# Altium project BOOST-DRV8711.PrjPcb
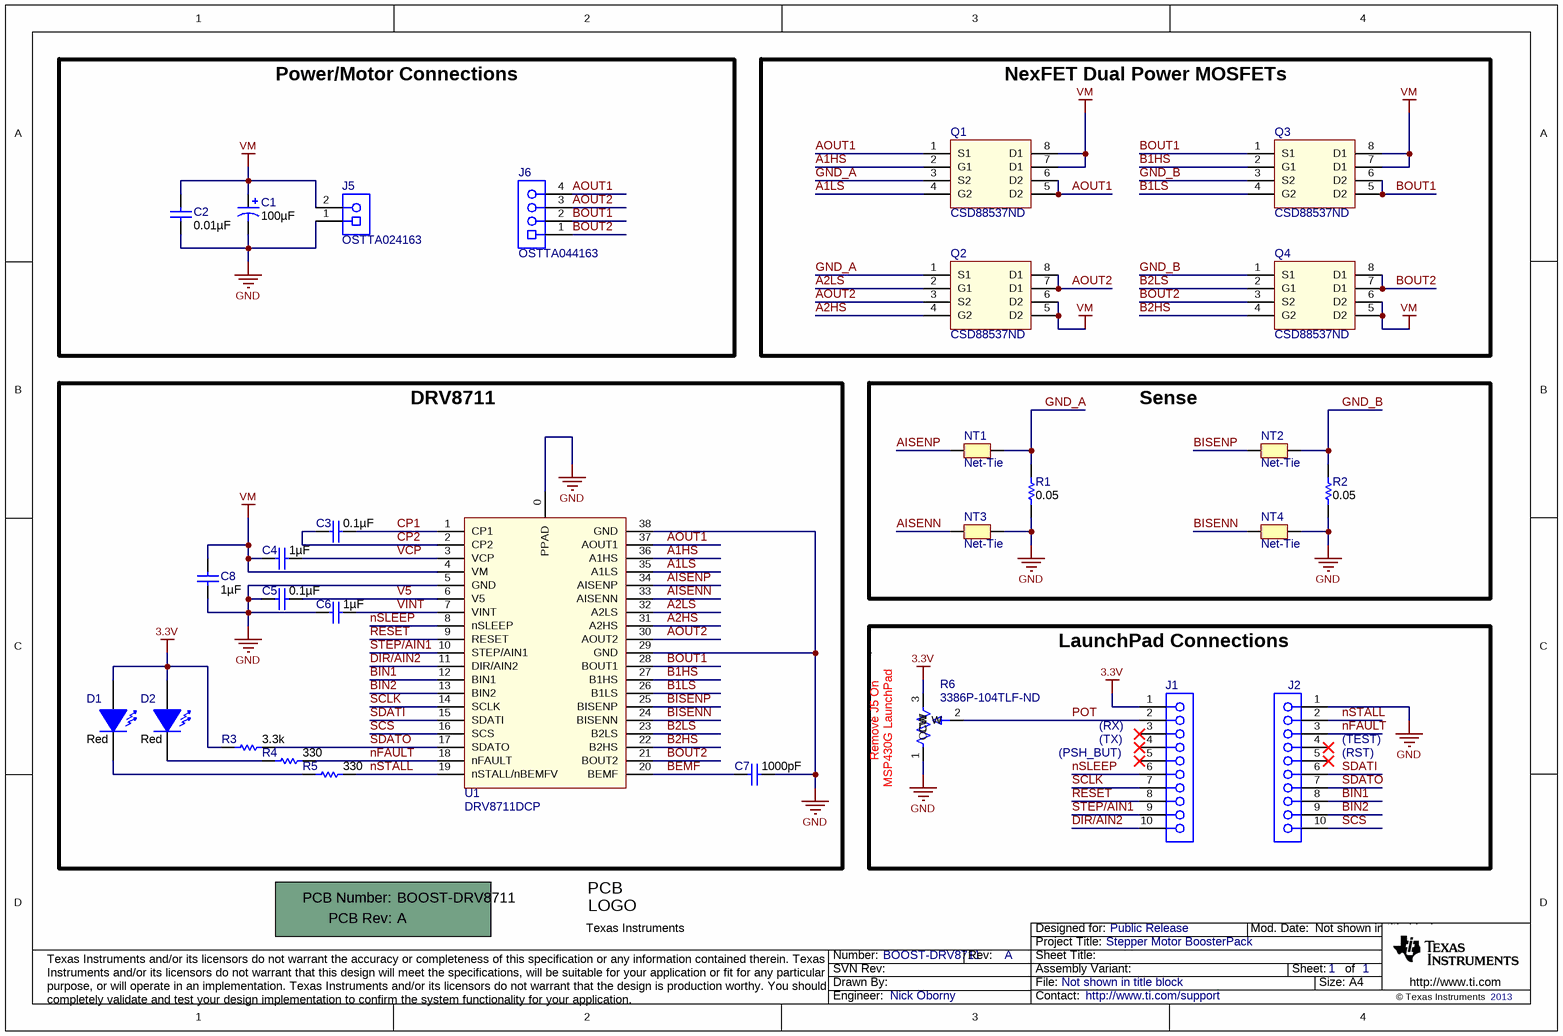
[diagram p0: BOOST-DRV8711.SchDoc]
TechSupport: http://www.ti.com/support; SCH_Rev: A; PRJ_Title: Stepper Motor BoosterPack; PRJ_Number: BOOST-DRV8711; PRJ_Engineer: Nick Oborny; PRJ_Customer: Public Release; PCB_Rev: A; PCB_Layout: Nick Oborny; CopyrightYear: 2013
1 sheet, 31 parts. Net scope: global (net labels, ports and power ports of the same name join across sheets).
Board file: BOOST-DRV8711.PcbDoc

## Sheet BOOST-DRV8711.SchDoc
size A4; Date: Not shown in title block; ApprovedBy: Not shown in title block; CheckedBy: Not shown in title block; Author: Not shown in title block; CompanyName: Not shown in title block; Engineer: Not shown in title block; Organization: Not shown in title block; Address1: Not shown in title block; Address2: Not shown in title block; Address3: Not shown in title block; Address4: Not shown in title block; DocumentNumber: 1; Revision: Use project parameter SCH_Rev; SheetNumber: 1; SheetTotal: 1; PageSetup: Record=PageOptions|CenterHorizontal=True|CenterVertical=True|PrintScale=1.00|XCorrection=1.00|YCorrection=1.00|PrintKind=0|BorderSize=5000000|LeftOffset=0|BottomOffset=0|Orientation=2|PaperLength=1000|PaperWidth=1000|Scale=100|PaperSource=15|PrintQuality=600|MediaType=1|DitherType=10|PaperKind=Letter|PrintScaleMode=1; CurrentTime: Not shown in title block; CurrentDate: Not shown in title block; Time: Not shown in title block; DocumentFullPathAndName: Not shown in title block; DocumentName: Not shown in title block; ModifiedDate: Not shown in title block; ImagePath: Not shown in title block

### Parts
!PCB  Printed Circuit Board  (value not drawn)  (mechanical)
C1  ValueDisplayed: 100µF  [CAPPR5-10X20]  (hidden comment: ECA-2AM101)
C2  ValueDisplayed: 0.01µF  [0603L]  (hidden comment: C1608X7R2A103K)
C3  ValueDisplayed: 0.1µF  [0603L]  (hidden comment: GRM188R72A104KA35D)
C4  ValueDisplayed: 1µF  [0805L]  (hidden comment: CL21B105KBFNNNE)
C5  ValueDisplayed: 0.1µF  [0603L]  (hidden comment: C1608X7R1E104K)
C6  ValueDisplayed: 1µF  [0603L]  (hidden comment: C1608X7R1C105K)
C7  ValueDisplayed: 1000pF  [0603L]  (hidden comment: C0603C102K4RACTU)
C8  ValueDisplayed: 1µF  [1206L]  (hidden comment: HMK316B7105KL-T)
D1  value Red  [LED_LTST-C170]  (hidden comment: LTST-C170KRKT)
D2  value Red  [LED_LTST-C170]  (hidden comment: LTST-C170KRKT)
J1  CRD-081413-B-T  [CONN_SSW-110-23-F-S]  (value not drawn)
J2  CRD-081413-B-T  [CONN_SSW-110-23-F-S]  (value not drawn)
J5  OSTTA024163  [CONN_ED120-2DS]
J6  OSTTA044163  [CONN_ED120_4DS]
Logo1  Texas Instruments  [TI_Symbol_Overlay_Small]  (no BOM)
NT1  Net-Tie  [Net-Tie_10mil]  (net tie, no BOM)
NT2  Net-Tie  [Net-Tie_10mil]  (net tie, no BOM)
NT3  Net-Tie  [Net-Tie_10mil]  (net tie, no BOM)
NT4  Net-Tie  [Net-Tie_10mil]  (net tie, no BOM)
Q1  CSD88537ND  [SO-8]
Q2  CSD88537ND  [SO-8]
Q3  CSD88537ND  [SO-8]
Q4  CSD88537ND  [SO-8]
R1  value 0.05  [2512M]  (hidden comment: CRA2512-FZ-R050ELF)
R2  value 0.05  [2512M]  (hidden comment: CRA2512-FZ-R050ELF)
R3  value 3.3k  [0603L]  (hidden comment: CRCW06033K30JNEA)
R4  value 330  [0603L]  (hidden comment: CRCW0603330RJNEA)
R5  value 330  [0603L]  (hidden comment: CRCW0603330RJNEA)
R6  3386P-104TLF-ND  [POT_3386P]
U1  DRV8711DCP  [R-PDSO-G38]

### Blocks framed on the sheet
Power/Motor Connections: C1 C2 J5 J6
NexFET Dual Power MOSFETs: Q1-Q4
DRV8711: C3-C8 D1 D2 R3-R5 U1
Sense: NT1-NT4 R1 R2

### Nets
3.3V: D1.1(A) D2.1(A) J1.1 R3.2 R6.3(CW)
GND: C1.2(-) C2.2 C5.2 C6.2 C7.2 C8.2 J2.1 J5.1 NT3.2 NT4.2 R1.1 R2.1 R6.1(CCW) U1.0(PPAD) U1.5(GND) U1.29(GND) U1.38(GND)
VM: C1.1(+) C2.1 C4.2 C8.1 J5.2 Q1.7(D1) Q1.8(D1) Q2.5(D2) Q2.6(D2) Q3.7(D1) Q3.8(D1) Q4.5(D2) Q4.6(D2) U1.4(VM)
A1HS: Q1.2(G1) U1.36(A1HS)
A1LS: Q1.4(G2) U1.35(A1LS)
A2HS: Q2.4(G2) U1.31(A2HS)
A2LS: Q2.2(G1) U1.32(A2LS)
AISENN: NT3.1 U1.33(AISENN)
AISENP: NT1.1 U1.34(AISENP)
AOUT1: J6.4 Q1.1(S1) Q1.5(D2) Q1.6(D2) U1.37(AOUT1)
AOUT2: J6.3 Q2.3(S2) Q2.7(D1) Q2.8(D1) U1.30(AOUT2)
B1HS: Q3.2(G1) U1.27(B1HS)
B1LS: Q3.4(G2) U1.26(B1LS)
B2HS: Q4.4(G2) U1.22(B2HS)
B2LS: Q4.2(G1) U1.23(B2LS)
BEMF: C7.1 U1.20(BEMF)
BIN1: J2.8 U1.12(BIN1)
BIN2: J2.9 U1.13(BIN2)
BISENN: NT4.1 U1.24(BISENN)
BISENP: NT2.1 U1.25(BISENP)
BOUT1: J6.2 Q3.1(S1) Q3.5(D2) Q3.6(D2) U1.28(BOUT1)
BOUT2: J6.1 Q4.3(S2) Q4.7(D1) Q4.8(D1) U1.21(BOUT2)
CP1: C3.1 U1.1(CP1)
CP2: C3.2 U1.2(CP2)
DIR/AIN2: J1.10 U1.11(DIR/AIN2)
GND_A: NT1.2 Q1.3(S2) Q2.1(S1) R1.2
GND_B: NT2.2 Q3.3(S2) Q4.1(S1) R2.2
nFAULT: J2.3 R4.2 U1.18(nFAULT)
nSLEEP: J1.6 U1.8(nSLEEP)
nSTALL: J2.2 R5.1 U1.19(nSTALL/nBEMFV)
POT: J1.2 R6.2(W)
RESET: J1.8 U1.9(RESET)
SCLK: J1.7 U1.14(SCLK)
SCS: J2.10 U1.16(SCS)
SDATI: J2.6 U1.15(SDATI)
SDATO: J2.7 R3.1 U1.17(SDATO)
STEP/AIN1: J1.9 U1.10(STEP/AIN1)
V5: C5.1 U1.6(V5)
VCP: C4.1 U1.3(VCP)
VINT: C6.1 U1.7(VINT)
NetD1_2: D1.2(K) R5.2
NetD2_2: D2.2(K) R4.1

Not connected (* = marked no-connect by the designer): J1 3* 4* 5*; J2 4* 5*

### Notes on the sheet
- LaunchPad Connections
- (near R6) Remove J5 On
- (near R6) MSP430G LaunchPad
- (near J1) (PSH_BUT)
- (near J1) (RX)
- (near J1) (TX)
- (near J2) (TEST)
- (near J2) (RST)
- Drawn By:
- SVN Rev:
- Number:
- Rev:
- Sheet Title:
- File:
- Project Title:
- Designed for:
- Assembly Variant:
- Mod. Date:
- Sheet:
- Size:
- of
- A4
- http://www.ti.com
- Texas Instruments and/or its licensors do not warrant the accuracy or completeness of this specification or any information contained therein. Texas Instruments and/or its licensors do not warrant that this design will meet the specifications, will be suitable for your application or fit for any particular purpose, or will operate in an implementation. Texas Instruments and/or its licensors do not warrant that the design is production worthy. You should completely validate and test your design implementation to confirm the system functionality for your application.
- Engineer:
- Contact:
- © Texas Instruments
- (in symbol PCB) PCB Number:; PCB Rev:
- (in symbol TI_Logo) PCB; LOGO

### Library data of the parts
!PCB = PCB: Manufacturer: Any; PartNumber: BOOST-DRV8711; SymbolCreator: a0412235; SymbolVersion: 2012-05-30; CompType: PCB; RoHS: O; MountType: N/A; Publisher: Texas Instruments; LatestRevisionDate: 2012-06-27; LatestRevisionNote: Initial Version; Alternate Manufacturer: -; Alternate PartNumber: -
C1 = EEV-FK2A101M: CAP ALUM 100UF 100V 20% RADIAL; Manufacturer: Panasonic Electronic Components; Polarized: Y; CompType: Capacitor; U/M: EA; Tolerance_%: 20; VDC_V: 100; TaMin_C: -40; TaMax_C: 85; SymbolVersion: 2008-07-09; Value: 100uF; PartNumber: ECA-2AM101; PackageReference: Radial, Can; RoHS: Y; Value2: 100V; MountType: TH; Technology: AL; Series: M Series; Publisher: Texas Instruments; LatestRevisionDate: 2013-07-14; ComponentLink1Description: Datasheet link; Supplier 1: Digi-Key; Supplier Part Number 1: P5313-ND
C2 = C1608X7R2A103K: CAP, CERM, 0.01uF, 100V, +/-10%, X7R, 0603; Manufacturer: TDK; Polarized: N; CompType: Capacitor; U/M: EA; Cap_F: 0.00000001; Tolerance_%: 10; ESR_Ohm: 0.0661; Value1: 0.0661 ohm; VDC_V: 100; TaMin_C: -55; TaMax_C: 125; Cap_Case: 0603; SymbolVersion: 2008-07-09; Value: 0.01uF; PartNumber: C1608X7R2A103K; PackageReference: 0603; RoHS: Y; Value2: 100V; MountType: SMT; Technology: Ceramic; TempCo: X7R; Published: 2008-06-19; Publisher: Texas Instruments; LatestRevisionDate: 2013-07-24; ComponentLink1Description: Datasheet link; ComponentLink1URL: http://www.tdk.co.jp/tefe02/e412_c.pdf; Supplier 1: Digi-Key; Supplier Part Number 1: 445-1304-1-ND; Supplier 2: Farnell; Supplier Part Number 2: 1907322
C3 = GRM188R72A104KA35D: CAP, CERM, 0.1uF, 100V, +/-10%, X7R, 0603; Manufacturer: MuRata; Polarized: N; CompType: Capacitor; U/M: EA; Cap_F: 0.0000001; Tolerance_%: 10; Value1: Unknown; VDC_V: 100; TaMin_C: -55; TaMax_C: 125; Cap_Case: 0603; SymbolVersion: 2008-07-09; Value: 0.1uF; PartNumber: GRM188R72A104KA35D; PackageReference: 0603; RoHS: Y; Value2: 100V; MountType: SMT; Technology: Ceramic; TempCo: X7R; Published: 2008-06-19; Publisher: Texas Instruments; LatestRevisionDate: 2013-07-24; ComponentLink1Description: Datasheet link; ComponentLink1URL: http://search.murata.co.jp/Ceramy/PnsearchViewAction.do?HnOFG=ON&HnNFG=ON&SEL_CNT=50&sLang=en&sKey=GRM188R72A104KA35D&x=9&y=9&search=startwith; Supplier 1: Digi-Key; Supplier Part Number 1: 490-3285-1-ND; Supplier 2: Mouser; Supplier Part Number 2: 81-GRM188R72A104KA35; Supplier 3: Farnell; Supplier Part Number 3: 1828921
C4 = GRM21BR71H105KA12L: CAP CER 1UF 50V 10% X7R 0805; Manufacturer: Samsung Electro-Mechanics America, Inc; Polarized: N; CompType: Capacitor; U/M: EA; Cap_F: 0.000001; Tolerance_%: 10; Value1: Unknown; VDC_V: 50; TaMin_C: -55; TaMax_C: 125; Cap_Case: 0805; SymbolVersion: 2008-07-09; Value: 1uF; PartNumber: CL21B105KBFNNNE; PackageReference: 0805; RoHS: Y; Value2: 50V; MountType: SMT; Technology: Ceramic; TempCo: X7R; Published: 2008-06-19; Publisher: Texas Instruments; LatestRevisionDate: 2013-07-24
C5 = C1608X7R1E104K: CAP, CERM, 0.1uF, 25V, +/-10%, X7R, 0603; Manufacturer: TDK; Polarized: N; CompType: Capacitor; U/M: EA; Cap_F: 0.0000001; Tolerance_%: 10; ESR_Ohm: 0.017; Value1: 0.017 ohm; VDC_V: 25; TaMin_C: -55; TaMax_C: 125; Cap_Case: 0603; SymbolVersion: 2008-07-09; Value: 0.1uF; PartNumber: C1608X7R1E104K; PackageReference: 0603; RoHS: Y; Value2: 25V; MountType: SMT; Technology: Ceramic; TempCo: X7R; Published: 2008-06-19; Publisher: Texas Instruments; LatestRevisionDate: 2013-07-24; ComponentLink1Description: Datasheet link; ComponentLink1URL: http://www.tdk.co.jp/tefe02/e412_c.pdf; Supplier 1: Digi-Key; Supplier Part Number 1: 445-1316-1-ND; Supplier 2: Farnell; Supplier Part Number 2: 1844230
C6 = C1608X7R1C105K: CAP, CERM, 1uF, 16V, +/-10%, X7R, 0603; Manufacturer: TDK; Polarized: N; CompType: Capacitor; U/M: EA; Cap_F: 0.000001; Tolerance_%: 10; ESR_Ohm: 0.0057; Value1: 0.0057 ohm; VDC_V: 16; TaMin_C: -55; TaMax_C: 125; Cap_Case: 0603; SymbolVersion: 2008-07-09; Value: 1uF; PartNumber: C1608X7R1C105K; PackageReference: 0603; RoHS: Y; Value2: 16V; MountType: SMT; Technology: Ceramic; TempCo: X7R; Published: 2008-06-19; Publisher: Texas Instruments; LatestRevisionDate: 2013-07-24; ComponentLink1Description: Datasheet link; ComponentLink1URL: http://www.tdk.co.jp/tefe02/e412_c.pdf; Supplier 1: Digi-Key; Supplier Part Number 1: 445-1604-1-ND; Supplier 2: Farnell; Supplier Part Number 2: 1907343
C7 = GRM188R71C102KA01D: CAP, CERM, 1000pF, 16V, +/-10%, X7R, 0603; Manufacturer: Kemet; Polarized: N; CompType: Capacitor; U/M: EA; Cap_F: 0.000000001; Tolerance_%: 10; Value1: Unknown; VDC_V: 16; TaMin_C: -55; TaMax_C: 125; Cap_Case: 0603; SymbolVersion: 2008-07-09; Value: 1000pF; PartNumber: C0603C102K4RACTU; PackageReference: 0603; RoHS: Y; Value2: 16V; MountType: SMT; Technology: Ceramic; TempCo: X7R; Published: 2008-06-19; Publisher: Texas Instruments; LatestRevisionDate: 2013-12-18
C8 = GRM31CR72A105KA01L: CAP CER 1UF 100V 10% X7R 1206; Manufacturer: Taiyo Yuden; Polarized: N; CompType: Capacitor; U/M: EA; Cap_F: 0.000001; Tolerance_%: 10; Value1: Unknown; VDC_V: 100; TaMin_C: -55; TaMax_C: 125; Cap_Case: 2220; SymbolVersion: 2008-07-09; Value: 1uF; PartNumber: HMK316B7105KL-T; PackageReference: 1206; RoHS: Y; Value2: 100V; MountType: SMT; Technology: Ceramic; TempCo: X7R; Published: 2008-06-19; Publisher: Texas Instruments; LatestRevisionDate: 2013-07-24
D1 D2 = LTST-C170KRKT: LED, Red, SMD; Manufacturer: Lite-On; Type: AlInGaP; Vf_V: 2; Value2: 2V; Io_A: 20; Value1: W; U/M: EA; CompType: LED; PartNumber: LTST-C170KRKT; SymbolVersion: 2008-12-08; MountType: SMT; RoHS: Y; PackageReference: LED_0805; Color: red; Published: 2008-07-11; Publisher: Texas Instruments; ComponentLink1URL: http://optoelectronics.liteon.com/en-us/api/DwonloadFileHandler.ashx?txtSpecNo=DS-22-99-0150&txtPartNo=LTST-C170KRKT; ComponentLink1Description: Datasheet link; LatestRevisionDate: 2013-07-19; LatestRevisionNote: Updated supplier queries; Supplier 1: Digi-Key; Supplier Part Number 1: 160-1415-1-ND; Supplier 2: Mouser; Supplier Part Number 2: 859-LTST-C170KRKT
J1 J2 = SSW-110-23-F-S: Connector, Receptacle, 100mil, 10x1, TH; Manufacturer: Major League Electronics; SymbolCreator: a0411947; U/M: EA; SymbolVersion: 2013-01-28; PartNumber: CRD-081413-B-T; CompType: Connector; RoHS: Y; PackageReference: 10x1 Receptacle; MountType: TH; Publisher: Texas Instruments; LatestRevisionDate: 2013-07-19
J5 = ED120/2DS: TERMINAL BLOCK 5.08MM VERT 2POS, TH; Manufacturer: On Shore Technology Inc; U/M: EA; SymbolVersion: 2013-09-04; PartNumber: OSTTA024163; PackageReference: TERM_BLK, 2pos, 5.08mm; CompType: Terminal Block; RoHS: Y; MountType: TH; ComponentLink1Description: Datasheet Link; ComponentLink1URL: http://www.on-shore.com/sites/default/files/manuals/ed120ds.pdf; Publisher: Texas Instruments; LatestRevisionDate: 2013-12-17
J6 = ED120/4DS: Terminal Block, 4x1, 5.08mm, TH; Manufacturer: On Shore Technology Inc; SymbolCreator: a0411947; U/M: EA; SymbolVersion: 2013-08-30; PartNumber: OSTTA044163; PackageReference: TERM_BLK, 4pos, 5.08mm; CompType: Terminal Block; RoHS: Y; MountType: TH; ComponentLink1Description: Datasheet Link; ComponentLink1URL: http://www.on-shore.com/sites/default/files/manuals/ed120ds.pdf; Publisher: Texas Instruments; LatestRevisionDate: 2013-12-17
Logo1 = TI_Logo: Texas Instrument Corporate Signature; SymbolCreator: codlsc; SymbolVersion: 2011-08-22; Published: 2009-03-03; Publisher: National Semiconductor; ClassName: Logo; LatestRevisionDate: 2011-10-25; LatestRevisionNote: Added ClassName of Logo.
NT1-NT4 = Net-Tie: Single point connection between nets.; SymbolCreator: codlsc; SymbolVersion: 2009-07-01; MountType: SMT; Publisher: Texas Instruments; LatestRevisionDate: 2013-07-24; LatestRevisionNote: Added Alternate PartNumber and Alternate Manufacturer parameters to appropriate components.
Q1-Q4 = CSD88537ND: Dual 60-V N-Channel NexFET™ Power MOSFETs; Manufacturer: Texas Instruments; SymbolCreator: a0273408; CompType: Used in some BOM reports.  Useful for finding later.; U/M: EA, IN, or GM; SymbolVersion: 2013-07-26; MountType: SMT; RoHS: Y; PartNumber: CSD88537ND; PackageReference: SO-8; ComponentLink1Description: Datasheet Link; Alternate PartNumber: -; Alternate Manufacturer: -
R1 R2 = CRA2512-FZ-R050ELF: RES, 0.05 ohm, 1%, 3W, 2512; Manufacturer: Bourns; CompType: Resistor; Value_Code: R050; Tolerance_%: 1; Power_W: 3; VDC_V: 0; TempCo: 75 ppm/C; EIA_Code: E96; U/M: EA; SymbolVersion: 2009-05-29; PartNumber: CRA2512-FZ-R050ELF; PackageReference: 2512; RoHS: Y; Res_ohm: 0.05; Value1: 1%; Value2: 3W; MountType: SMT; Technology: Metal Film; Published: 2008-06-26; Publisher: Texas Instruments; LatestRevisionDate: 2013-07-24; ComponentLink1Description: Datasheet link; ComponentLink1URL: http://www.bourns.com/data/global/pdfs/CRA.pdf; Supplier 1: Digi-Key; Supplier Part Number 1: CRA2512-FZ-R050ELFCT-ND; Supplier 2: Mouser; Supplier Part Number 2: 652-CRA2512FZ-R50ELF; Supplier 3: Farnell; Supplier Part Number 3: 1435950
R3 = CRCW06033K30JNEA: RES, 3.3k ohm, 5%, 0.1W, 0603; Manufacturer: Vishay-Dale; CompType: Resistor; Res_ohm: 3300; Value_Code: 3k30; Tolerance_%: 5; Power_W: 0.1; VDC_V: 75; TempCo: 200 ppm/C; EIA_Code: E24; U/M: EA; SymbolVersion: 2009-05-29; PartNumber: CRCW06033K30JNEA; PackageReference: 0603; RoHS: Y; Value1: 5%; Value2: 0.1W; MountType: SMT; Technology: Thick Film; Published: 2008-06-26; Publisher: Texas Instruments; LatestRevisionDate: 2013-07-19; ComponentLink1Description: Datasheet link; ComponentLink1URL: http://www.vishay.com/docs/20035/dcrcwe3.pdf; Supplier 1: Digi-Key; Supplier Part Number 1: 541-3.3KGCT-ND; Supplier 2: Farnell; Supplier Part Number 2: 1514749; Supplier 3: Newark; Supplier Part Number 3: 59M6796
R4 R5 = CRCW0603330RJNEA: RES, 330 ohm, 5%, 0.1W, 0603; Manufacturer: Vishay-Dale; CompType: Resistor; Value_Code: 330R; Tolerance_%: 5; Power_W: 0.1; VDC_V: 75; TempCo: 200 ppm/C; EIA_Code: E24; U/M: EA; SymbolVersion: 2009-05-29; PartNumber: CRCW0603330RJNEA; PackageReference: 0603; RoHS: Y; Res_ohm: 330; Value1: 5%; Value2: 0.1W; MountType: SMT; Technology: Thick Film; Published: 2008-06-26; Publisher: Texas Instruments; LatestRevisionDate: 2013-07-19; ComponentLink1Description: Datasheet link; ComponentLink1URL: http://www.vishay.com/docs/20035/dcrcwe3.pdf; Supplier 1: Digi-Key; Supplier Part Number 1: 541-330GCT-ND; Supplier 2: Mouser; Supplier Part Number 2: 71-CRCW0603J-330-E3; Supplier 3: Farnell; Supplier Part Number 3: 1692522
R6 = POT_3386P: TRIMMER 100K OHM 0.5W PC PIN; Manufacturer: Bourns; Area: 148225; ComponentHeight: 0.210 inch; PackageReference: 0.375 sq inch; SymbolVersion: 07/31/2009 12:17:30; PartNumber: 3386P-104TLF-ND; Value: 100k; ComponentLink1Description: AEO Datasheet Link
U1 = DRV8711DCP: Stepper Motor Pre-Driver with On-Chip 1/256 Micro-Stepping Indexer and Stall Detect; Manufacturer: Texas Instruments; SymbolCreator: a0273408; CompType: Used in some BOM reports.  Useful for finding later.; U/M: EA, IN, or GM; SymbolVersion: 2013-07-23; MountType: SMT; RoHS: Y; PartNumber: DRV8711DCP; PackageReference: DCP; ComponentLink1Description: Datasheet Link; Alternate PartNumber: -; Alternate Manufacturer: -

## Assembly variants
001: all parts fitted